# EAGLE schematic PR5002-S (EAGLE 6.5.0)
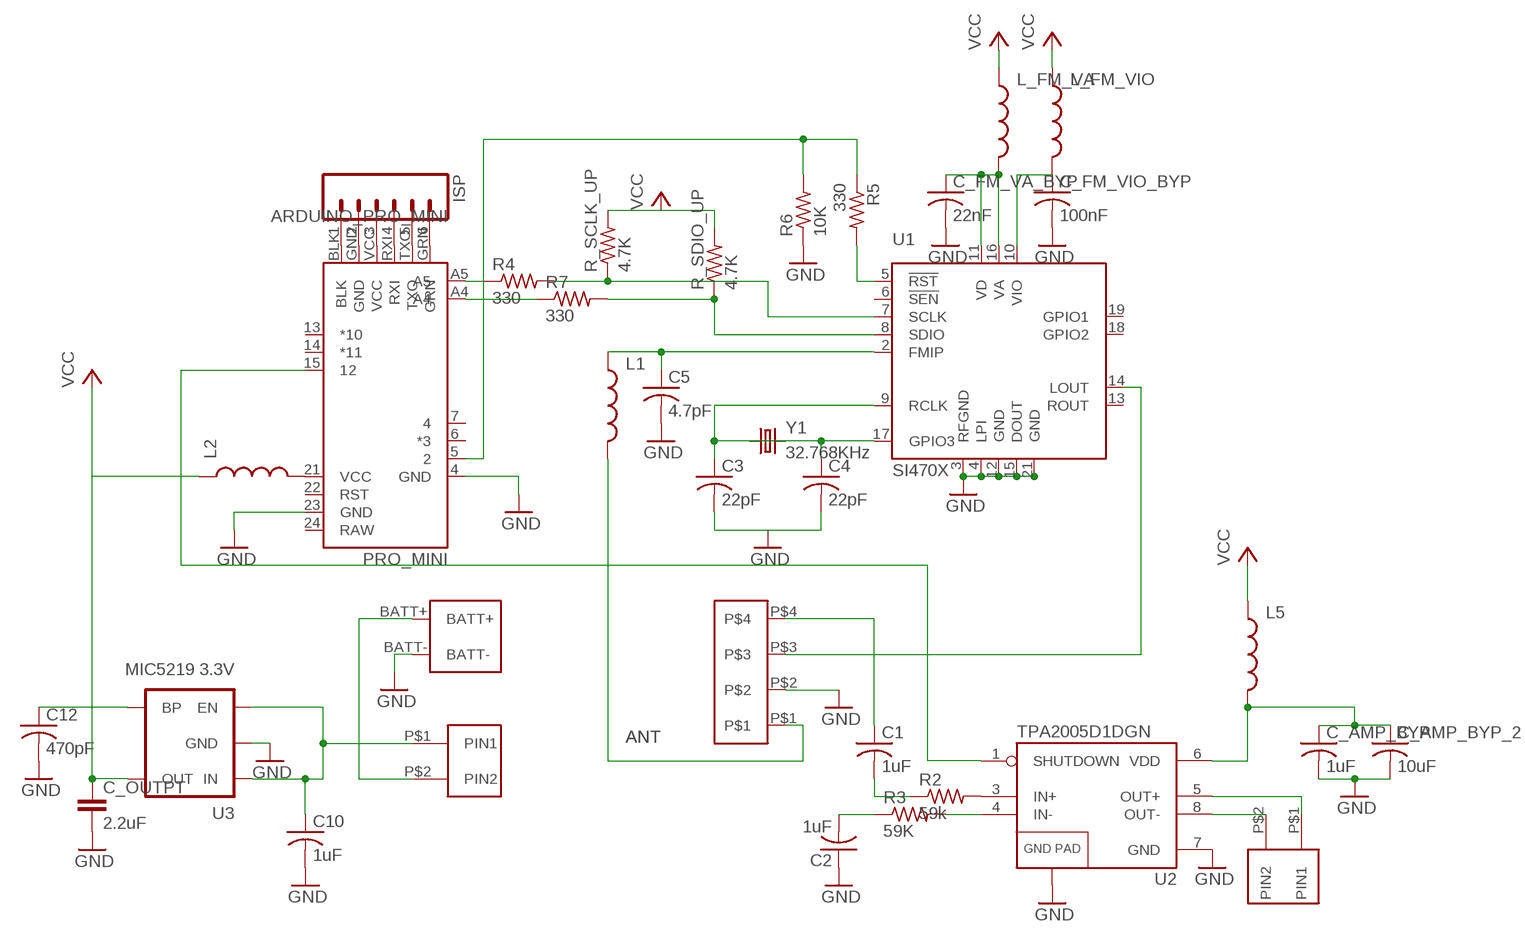
[diagram p0: schematic, sheet 1]

## Parts
ANT/POT_VOL  OSTVN04  [OSTVN04]
BATT_IN  KEYSTONE_2479_3XAAA_BOTTOM  [KEYSTONE_2479_3XAAA_BOTTOM]
C1  1uF  C-USC0603  [C0603]
C2  1uF  C-USC0603  [C0603]
C3  22pF  C-USC0603  [C0603]
C4  22pF  C-USC0603  [C0603]
C5  4.7pF  C-USC0603  [C0603]
C10  1uF  C-USC0603  [C0603]
C12  470pF  C-USC0603  [C0603]
C_AMP_BYP  1uF  C-USC0603  [C0603]
C_AMP_BYP_2  10uF  C-USC0603  [C0603]
C_FM_VA_BYP  22nF  C-USC0603  [C0603]
C_FM_VIO_BYP  100nF  C-USC0603  [C0603]
C_OUTPT  2.2uF  VISHAY_TR3C  [VISHAY_TR3C]
ISP  M06LOCK_LONGPADS  [1X06_LOCK_LONGPADS]
L1  INDUCTOR0805  [0805]
L2  INDUCTOR0603  [0603]
L5  INDUCTOR0603  [0603]
L_FM_VA  INDUCTOR0603  [0603]
L_FM_VIO  INDUCTOR0603  [0603]
POT_SW  OSTVN02  [OSTVN02]
PRO_MINI  ARDUINO_PRO_MINI  [ARDUINO_PRO_MINI]
R2  59k  R-US_R0603  [R0603]
R3  59K  R-US_R0603  [R0603]
R4  330  R-US_R0603  [R0603]
R5  330  R-US_R0603  [R0603]
R6  10K  R-US_R0603  [R0603]
R7  330  R-US_R0603  [R0603]
R_SCLK_UP  4.7K  R-US_R0603  [R0603]
R_SDIO_UP  4.7K  R-US_R0603  [R0603]
SPKR  OSTVN02  [OSTVN02]
U1  SI470X  [SI470X]
U2  TPA2005D1DGN  [POWER-SOP8]
U3  MIC5219 3.3V  V_REG_MIC52193.3V  [SOT23-5]
Y1  32.768KHz  CRYSTAL32-SMD  [CRYSTAL-32KHZ-SMD]

## Nets
ANT: ANT/POT_VOL.P$1 L1.2
BATT+: BATT_IN.BATT+ POT_SW.P$2(PIN2)
GND [GND]: ANT/POT_VOL.P$2 BATT_IN.BATT- C2.1 C3.2 C4.2 C5.2 C10.2 C12.2 C_AMP_BYP.2 C_AMP_BYP_2.2 C_FM_VA_BYP.2 C_FM_VIO_BYP.2 C_OUTPT.P$2 PRO_MINI.4(GND) PRO_MINI.23(GND) R6.1 U1.3(RFGND) U1.4(LPI) U1.12(GND) U1.15(DOUT) U1.21(GND) U2.7(GND) U2.9(GND) U3.2(GND)
N$1: C2.2 R3.1
N$2: C1.2 R2.1
N$3: C3.1 U1.9(RCLK) Y1.X2
N$4: R5.2 U1.5(!RST)
N$5: PRO_MINI.A5 R4.1
N$6: R4.2 R_SCLK_UP.1 U1.7(SCLK)
N$7: PRO_MINI.A4 R7.1
N$8: PRO_MINI.5 R5.1 R6.2
N$9: R7.2 R_SDIO_UP.1 U1.8(SDIO)
N$10: C5.1 L1.1 U1.2(FMIP)
N$11: C4.1 U1.17(GPIO3) Y1.X1
N$12: ISP.6 PRO_MINI.GRN
N$13: ISP.5 PRO_MINI.TXO
N$14: R2.2 U2.3(IN+)
N$15: R3.2 U2.4(IN-)
N$16: SPKR.P$2(PIN2) U2.8(OUT-)
N$17: SPKR.P$1(PIN1) U2.5(OUT+)
N$18: ISP.4 PRO_MINI.RXI
N$19: ANT/POT_VOL.P$3 U1.14(LOUT)
N$20: C10.1 POT_SW.P$1(PIN1) U3.1(IN) U3.3(EN)
N$21: ISP.3 PRO_MINI.VCC
N$22: ISP.2 PRO_MINI.GND
N$23: ISP.1 PRO_MINI.BLK
N$25: PRO_MINI.15 U2.1(SHUTDOWN)
N$27: ANT/POT_VOL.P$4 C1.1
N$28: C12.1 U3.4(BP)
N$29: L2.2 PRO_MINI.21(VCC)
N$30: C_FM_VIO_BYP.1 L_FM_VIO.2 U1.10(VIO)
N$31: C_FM_VA_BYP.1 L_FM_VA.2 U1.11(VD) U1.16(VA)
N$33: C_AMP_BYP.1 C_AMP_BYP_2.1 L5.2 U2.6(VDD)
VCC: C_OUTPT.P$1 L2.1 L5.1 L_FM_VA.1 L_FM_VIO.1 R_SCLK_UP.2 R_SDIO_UP.2 U3.5(OUT)
Unconnected: PRO_MINI.6(*3) PRO_MINI.7 PRO_MINI.13(*10) PRO_MINI.14(*11) PRO_MINI.22(RST) PRO_MINI.24(RAW) U1.6(!SEN) U1.13(ROUT) U1.18(GPIO2) U1.19(GPIO1)

## Library data of the parts
ANT/POT_VOL = OSTVN On-Shore Term:OSTVN04
BATT_IN = Batteries:KEYSTONE_2479_3XAAA_BOTTOM
C1-C5 C10 C12 C_AMP_BYP C_AMP_BYP_2 C_FM_VA_BYP C_FM_VIO_BYP = resistor:C-US: CAPACITOR, American symbol
C_OUTPT = capacitor-wima:VISHAY_TR3C
ISP = SparkFun-Connectors:M06: Header 6 Standard 6-pin 0.1" header. Use with straight break away headers (SKU : PRT-00116), right angle break away headers (PRT-00553), swiss pins (PRT-00743), machine pins (PRT-00117), and female headers (PRT-00115). Molex polarized connector foot print use with SKU : PRT-08094 with associated crimp pins and housings. NOTES ON THE VARIANTS LOCK and LOCK_LONGPADS... This footprint was designed to help hold the alignment of a through-hole component (i.e. 6-pin header) while soldering it into place. You may notice that each hole has been shifted either up or down by 0.005 of an inch from it's more standard position (which is a perfectly straight line). This slight alteration caused the pins (the squares in the middle) to touch the edges of the holes. Because they are alternating, it causes a "brace" to hold the component in place. 0.005 has proven to be the perfect amount of "off-center" position when using our standard breakaway headers. Although looks a little odd when you look at the bare footprint, once you have a header in there, the alteration is very hard to notice. Also,if you push a header all the way into place, it is covered up entirely on the bottom side. This idea of altering the position of holes to aid alignment will be further integrated into the Sparkfun Library for other footprints. It can help hold any component with 3 or more connection pins.
L1 L2 L5 L_FM_VA L_FM_VIO = SparkFun-Passives:INDUCTOR: Inductors Basic Inductor/Choke - 0603 and 1206. Footprints are not proven and vary greatly between part numbers. SRN6045- 33uH, 20% 1.4A SDR0403-560KL - 56uH, 10%, 500mA RMS/740mA peak
POT_SW SPKR = OSTVN On-Shore Term:OSTVN02
PRO_MINI = Sparkfun_MODIFIED:ARDUINO_PRO_MINI
R2-R7 R_SCLK_UP R_SDIO_UP = resistor:R-US_: RESISTOR, American symbol
U1 = SparkFun-RF:SI470X: FM receiver IC. Tested with Si4703. You really only need SEN, RST, SCLK, and SDIO to get a full FM radio working. Antenna comes from headphone jack. See BOB-10344.
U2 = SparkFun-AnalogIC:TPA2005D1: 1.4W MONO CLASS-D AUDIO POWER AMPLIFIER The TPA2005D1 is a 1.4-W high efficiency filter-free class-D audio power amplifier in a BGA, QFN, or MSOP package that requires only three external components. Datasheet: http://focus.ti.com/lit/ds/symlink/tpa2005d1.pdf 1.4 W Into 8 ? From a 5V Supply at THD = 10% (Typ) Maximum Battery Life and Minimum Heat Efficiency With an 8-? Speaker: 84% at 400 mW, 79% at 100 mW 2.8-mA Quiescent Current 0.5-mA Shutdown Current Ideal for Wireless or Cellular Handsets and PDAs Capable of Driving an 8-? Speaker (2.5 V ? VDD ? 5.5 V) and a 4-? Speaker (2.5 V ? VDD ? 4.2 V) Only Three External Components Optimized PWM Output Stage Eliminates LC Output Filter Internally Generated 250-kHz Switching Frequency Eliminates Capacitor and Resistor Improved PSRR (-71 dB at 217 Hz) and Wide Supply Voltage (2.5 V to 5.5 V) Eliminates Need for a Voltage Regulator Fully Differential Design Reduces RF Rectification and Eliminates Bypass Capacitor Improved CMRR Eliminates Two Input Coupling Capacitors
U3 = SparkFun-PowerIC:V_REG_MIC5219: V_REG MIC5219 Standard 3.3V and 5V 500mA LDO voltage regulator in SOT-23 layout. Micrel part MIC5219. BP (by-pass) pin is used to lower output noise with 470pF cap, may be left open.; PROD_ID: VREG-09872
Y1 = SparkFun-FreqCtrl:CRYSTAL: Various standard crystals. Proven footprints. Spark Fun Electronics SKU : COM-00534; PROD_ID: XTAL-07894

## Net classes
1 GND: width 0.61 mm